# Altium schematic sheet Log and Anti-Log.SchDoc
size Letter; SheetNumber: 7; SheetTotal: 14
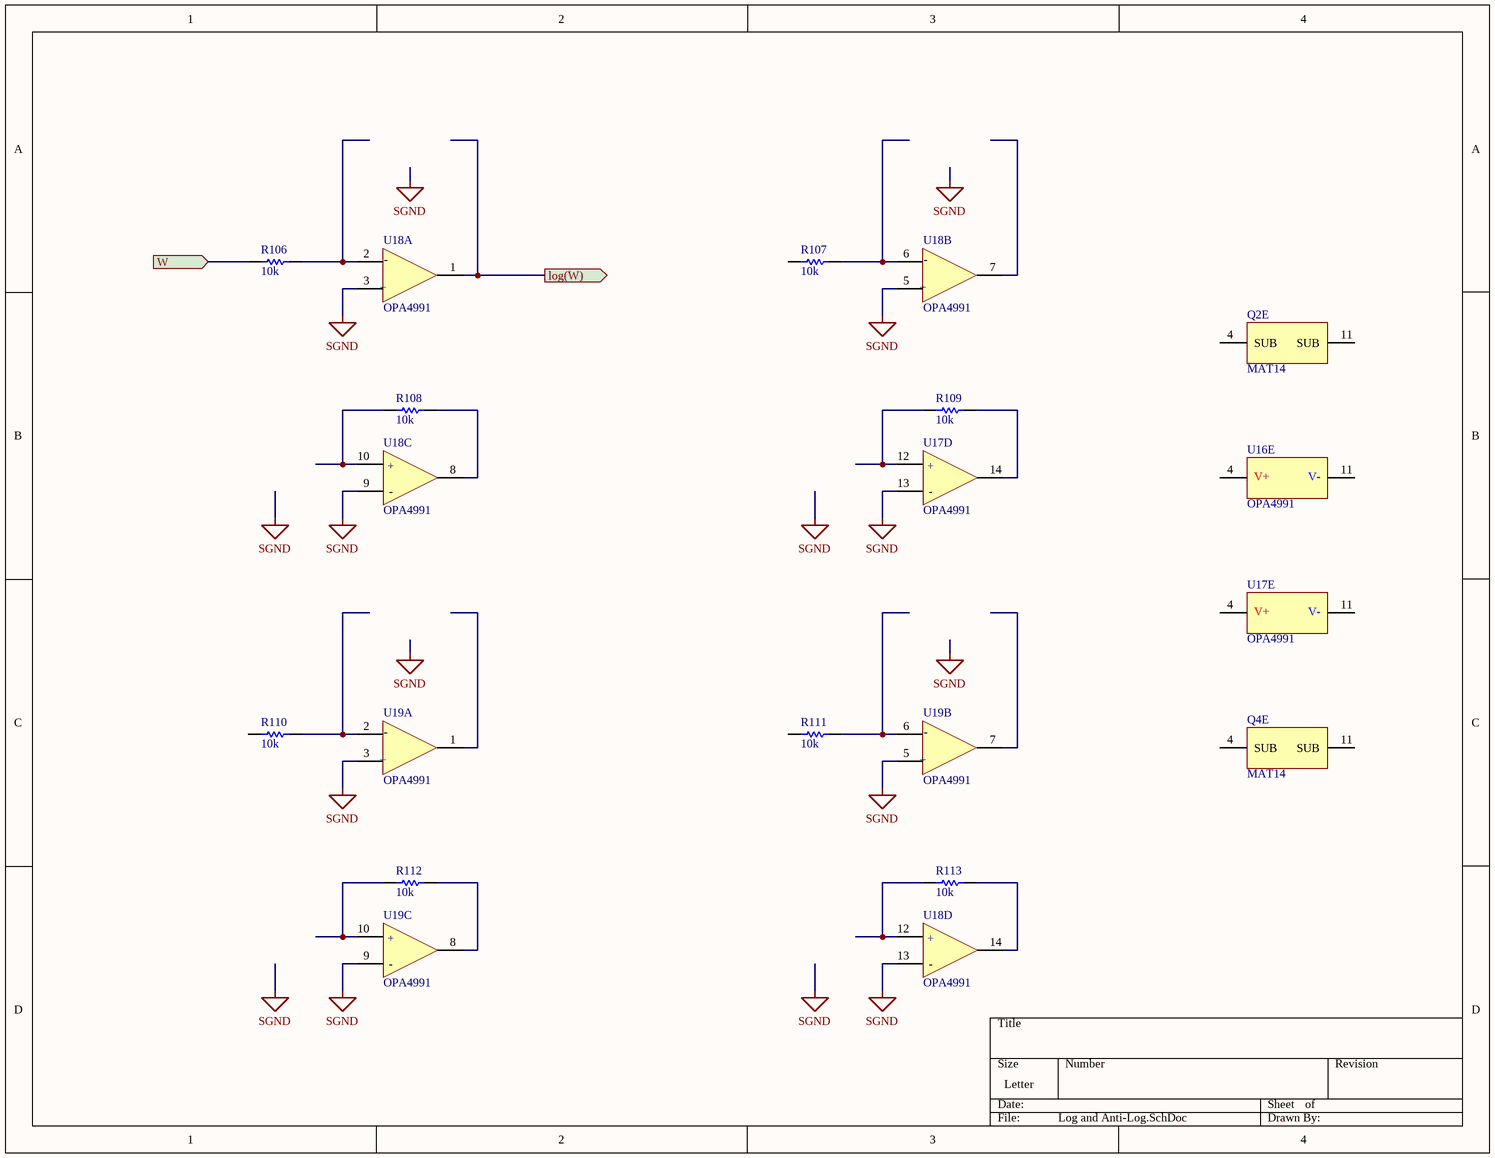
[diagram p0: Log and Anti-Log.SchDoc]

## Parts
Q2  MAT14  [FP-R-14-IPC_B]  (part E of 5)
Q4  MAT14  [FP-R-14-IPC_B]  (part E of 5)
R106  value 10k  (hidden comment: Resistor)
R107  value 10k  (hidden comment: Resistor)
R108  value 10k  (hidden comment: Resistor)
R109  value 10k  (hidden comment: Resistor)
R110  value 10k  (hidden comment: Resistor)
R111  value 10k  (hidden comment: Resistor)
R112  value 10k  (hidden comment: Resistor)
R113  value 10k  (hidden comment: Resistor)
U16  OPA4991  [FP-D0014A-IPC_B]  (part E of 5)
U17  OPA4991  [FP-D0014A-IPC_B]  (parts D,E of 5)
U18  OPA4991  [FP-D0014A-IPC_B]  (parts A,B,C,D of 5)
U19  OPA4991  [FP-D0014A-IPC_B]  (parts A,B,C of 5)

## Ports
log(W) (out), W (in)

## Nets
SGND: U17.13(IN4-) U18.3(IN1+) U18.5(IN2+) U18.9(IN3-) U18.13(IN4-) U19.3(IN1+) U19.5(IN2+) U19.9(IN3-)
log(W): U18.1(OUT1) ; port log(W)
W: R106.1 ; port W
NetR106_2: R106.2 U18.2(IN1-)
NetR107_2: R107.2 U18.6(IN2-)
NetR108_1: R108.1 U18.10(IN3+)
NetR108_2: R108.2 U18.8(OUT3)
NetR109_1: R109.1 U17.12(IN4+)
NetR109_2: R109.2 U17.14(OUT4)
NetR110_2: R110.2 U19.2(IN1-)
NetR111_2: R111.2 U19.6(IN2-)
NetR112_1: R112.1 U19.10(IN3+)
NetR112_2: R112.2 U19.8(OUT3)
NetR113_1: R113.1 U18.12(IN4+)
NetR113_2: R113.2 U18.14(OUT4)

Not connected (* = marked no-connect by the designer): Q2 4(SUB) 11(SUB); Q4 4(SUB) 11(SUB); R107 1; R110 1; R111 1; U16 4(V+) 11(V-); U17 4(V+) 11(V-); U18 7(OUT2); U19 1(OUT1) 7(OUT2)

## Notes on the sheet
- (in symbol OPA4991IDR, part A) -; +
- (in symbol OPA4991IDR, part B) -; +
- (in symbol OPA4991IDR, part C) +; -
- (in symbol OPA4991IDR, part D) +; -

## Library data of the parts
Q2 Q4 = MAT14ARZ: TRANS 4NPN 40V 0.03A 14SO; Transition Frequency: 300MHz; Max Collector Current: 30mA; Max Frequency: 1kHz; Collector-emitter Voltage-Max: 60mV; Number of Elements: 4; Polarity: NPN; Max Operating Temperature: 85°C; Collector Emitter Voltage (VCEO): 40V; Collector Emitter Breakdown Voltage: 40V; REACH SVHC: No SVHC; Series: MAT14; Collector Base Voltage (VCBO): 40V; Mount: Surface Mount; Packaging: Rail/Tube; Package Quantity: 56; Case/Package: SOIC; Min Operating Temperature: -40°C; Length: 8.75mm; RoHS Compliant: Yes; Frequency: 300MHz; Radiation Hardening: No; Lead Free: Contains Lead; Collector Emitter Saturation Voltage: 60mV; Height: 1.5mm; Width: 4mm; Number of Pins: 14
R106-R113 = Resistor: TC1: 0; SimulationGenericComponent: True; TC2: 0
U16-U19 = OPA4991IDR: 40-V, DUAL 4.5MHZ, RAIL-TO-RAIL